# EAGLE schematic quad_probability_gate (EAGLE 8.0.0)
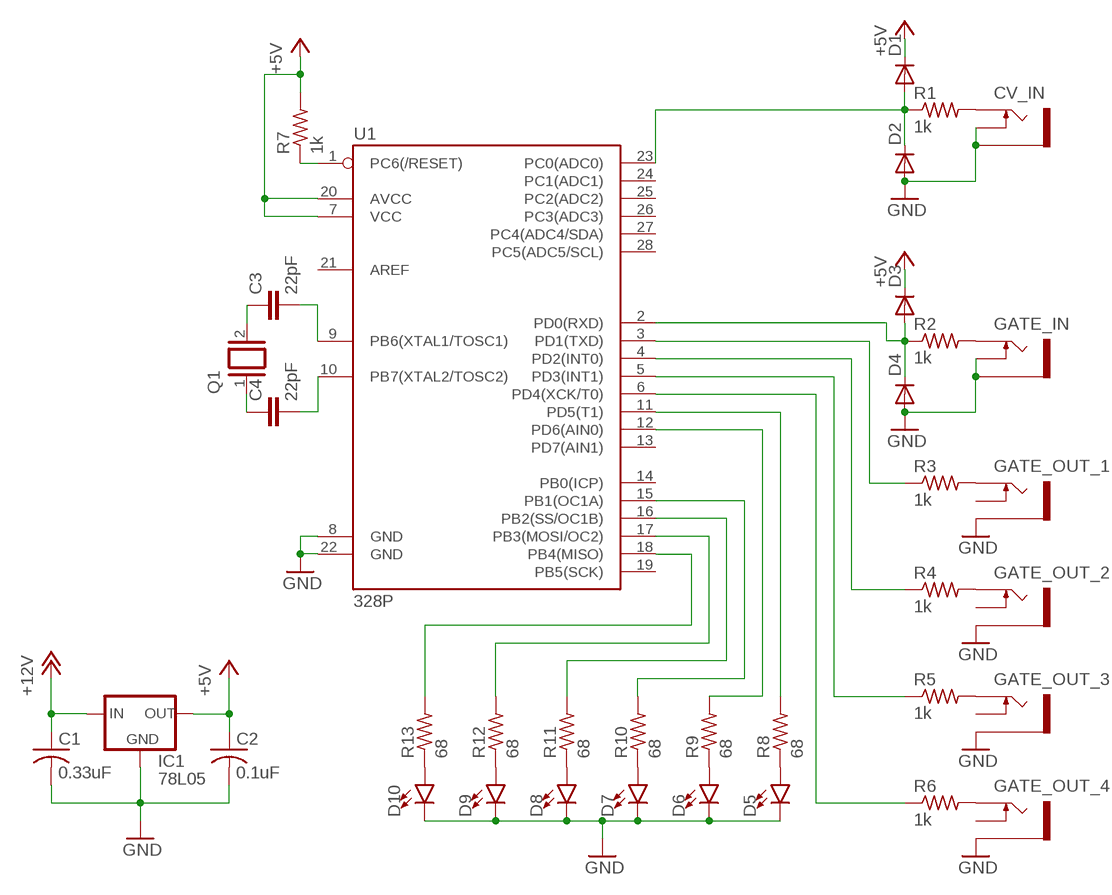
[diagram p0: schematic, sheet 1]

## Parts
C1  0.33uF  C-US025-024X044  [C025-024X044]
C2  0.1uF  C-US025-024X044  [C025-024X044]
C3  22pF  22PF-0603-50V-5%  [0603]
C4  22pF  22PF-0603-50V-5%  [0603]
CV_IN  THONKICONNOLD  [THONKICONN]
D1  SMALL_DIODEDO35-7  [DO35-7]
D2  SMALL_DIODEDO35-7  [DO35-7]
D3  SMALL_DIODEDO35-7  [DO35-7]
D4  SMALL_DIODEDO35-7  [DO35-7]
D5  LED-3MM-NO_SILK  [LED_3MM-NS]
D6  LED-3MM-NO_SILK  [LED_3MM-NS]
D7  LED-3MM-NO_SILK  [LED_3MM-NS]
D8  LED-3MM-NO_SILK  [LED_3MM-NS]
D9  LED-3MM-NO_SILK  [LED_3MM-NS]
D10  LED-3MM-NO_SILK  [LED_3MM-NS]
GATE_IN  THONKICONNOLD  [THONKICONN]
GATE_OUT_1  THONKICONNOLD  [THONKICONN]
GATE_OUT_2  THONKICONNOLD  [THONKICONN]
GATE_OUT_3  THONKICONNOLD  [THONKICONN]
GATE_OUT_4  THONKICONNOLD  [THONKICONN]
IC1  78L05  78LXX  [78LXX]
Q1  XTAL  [Q]
R1  1k  R-US_0204/2V  [0204V]
R2  1k  R-US_0204/2V  [0204V]
R3  1k  R-US_0204/2V  [0204V]
R4  1k  R-US_0204/2V  [0204V]
R5  1k  R-US_0204/2V  [0204V]
R6  1k  R-US_0204/2V  [0204V]
R7  1k  R-US_0204/2V  [0204V]
R8  68  R-US_0204/2V  [0204V]
R9  68  R-US_0204/2V  [0204V]
R10  68  R-US_0204/2V  [0204V]
R11  68  R-US_0204/2V  [0204V]
R12  68  R-US_0204/2V  [0204V]
R13  68  R-US_0204/2V  [0204V]
U1  328P  ATMEGA328P_PDIP  [DIP28]

## Nets
+5V: C2.1 D1.C D3.C IC1.OUT R7.2 U1.7(VCC) U1.20(AVCC)
+12V: C1.1 IC1.IN
GND: C1.2 C2.2 CV_IN.P$1_SLEEVE(SLEEVE) CV_IN.P$2_SWITCH(SWITCH) D2.A D4.A D5.K(C) D6.K(C) D7.K(C) D8.K(C) D9.K(C) D10.K(C) GATE_IN.P$1_SLEEVE(SLEEVE) GATE_IN.P$2_SWITCH(SWITCH) GATE_OUT_1.P$1_SLEEVE(SLEEVE) GATE_OUT_2.P$1_SLEEVE(SLEEVE) GATE_OUT_3.P$1_SLEEVE(SLEEVE) GATE_OUT_4.P$1_SLEEVE(SLEEVE) IC1.GND U1.8(GND) U1.22(GND)
N$1: C3.1 Q1.2
N$2: C4.1 Q1.1
N$3: C3.2 U1.9(PB6(XTAL1/TOSC1))
N$4: C4.2 U1.10(PB7(XTAL2/TOSC2))
N$5: D1.A D2.C R1.1 U1.23(PC0(ADC0))
N$6: D3.A D4.C R2.1 U1.2(PD0(RXD))
N$7: CV_IN.P$3_TIP(TIP) R1.2
N$8: GATE_IN.P$3_TIP(TIP) R2.2
N$9: GATE_OUT_1.P$3_TIP(TIP) R3.2
N$10: GATE_OUT_2.P$3_TIP(TIP) R4.2
N$11: GATE_OUT_3.P$3_TIP(TIP) R5.2
N$12: GATE_OUT_4.P$3_TIP(TIP) R6.2
N$13: R3.1 U1.3(PD1(TXD))
N$14: R4.1 U1.4(PD2(INT0))
N$15: R5.1 U1.5(PD3(INT1))
N$16: R6.1 U1.6(PD4(XCK/T0))
N$17: D5.A R8.1
N$18: R7.1 U1.1(PC6(/RESET))
N$19: D6.A R9.1
N$20: D7.A R10.1
N$21: D8.A R11.1
N$22: D9.A R12.1
N$23: D10.A R13.1
N$24: R8.2 U1.11(PD5(T1))
N$25: R9.2 U1.12(PD6(AIN0))
N$26: R10.2 U1.15(PB1(OC1A))
N$27: R11.2 U1.16(PB2(SS/OC1B))
N$28: R12.2 U1.17(PB3(MOSI/OC2))
N$29: R13.2 U1.18(PB4(MISO))
Unconnected: GATE_OUT_1.P$2_SWITCH(SWITCH) GATE_OUT_2.P$2_SWITCH(SWITCH) GATE_OUT_3.P$2_SWITCH(SWITCH) GATE_OUT_4.P$2_SWITCH(SWITCH) U1.13(PD7(AIN1)) U1.14(PB0(ICP)) U1.19(PB5(SCK)) U1.21(AREF) U1.24(PC1(ADC1)) U1.25(PC2(ADC2)) U1.26(PC3(ADC3)) U1.27(PC4(ADC4/SDA)) U1.28(PC5(ADC5/SCL))

## Library data of the parts
C1 C2 = rcl:C-US: CAPACITOR, American symbol
C3 C4 = SparkFun-Capacitors:22PF: 22pF ceramic capacitors A capacitor is a passive two-terminal electrical component used to store electrical energy temporarily in an electric field.; PROD_ID: CAP-07876
CV_IN GATE_IN GATE_OUT_1-GATE_OUT_4 = MusicThingModular:THONKICONN: 3.5mm socket for Eurorack modular synths
D1-D4 = MusicThingModular:SMALL_DIODE: Small Signal Diode
D5-D10 = SparkFun-LED:LED: LED (Generic) Standard schematic elements and footprints for 5mm, 3mm, 1206, and 0603 sized LEDs. Generic LEDs with no color specified.
IC1 = v-reg:78LXX: VOLTAGE REGULATOR
Q1 = special:XTAL: CRYSTAL
R1-R13 = rcl:R-US_: RESISTOR, American symbol
U1 = SparkFun-IC-Microcontroller:ATMEGA328P_PDIP: Atmel 328P Through hole ATMEGA328P uC used in the Arduino 32kb flash, 1k EEPROM, 2k SRAM Datasheet <http://www.sparkfun.com/datasheets/Components/SMD/ATMega328.pdf> SparkFun Products Storefront component: AVR 28 Pin 20MHz 32K 6A/D - ATMega328P <https://www.sparkfun.com/products/9061> (COM-09061) SparkFun Simon Says - Through-Hole Soldering Kit <https://www.sparkfun.com/products/10547> (KIT-10547) SparkFun Learn to Solder - Simon Says <https://www.sparkfun.com/products/13708> (KIT-13708) SparkFun BigTime Watch Kit <https://www.sparkfun.com/products/11734> (KIT-11734) SparkFun ClockIt <https://www.sparkfun.com/products/10930> (KIT-10930) SparkFun Serial Enabled LCD Kit <https://www.sparkfun.com/products/10097> (LCD-10097) SparkFun Simon Tilts - Through Hole Soldering Kit <https://www.sparkfun.com/products/12634> (KIT-12634) SparkFun Frequency Counter Kit <https://www.sparkfun.com/products/10140> (KIT-10140) FabFM Radio Kit <https://www.sparkfun.com/products/11043> (KIT-11043) SparkFun Binary Blaster Kit <https://www.sparkfun.com/products/12037> (KIT-12037) SparkFun Metro-Gnome <https://www.sparkfun.com/products/9236> (KIT-09236) ATmega328 with Arduino Optiboot (Uno) <https://www.sparkfun.com/products/10524> (DEV-10524); PROD_ID: IC-09136